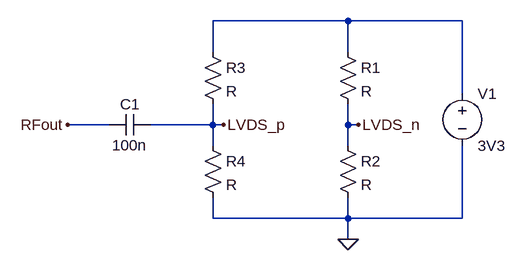
[diagram p0: schematic LVDS bias.asc]
LVDS bias.asc, the LTspice schematic file:
Version 4
SHEET 1 880 680
WIRE 192 32 -16 32
WIRE 368 32 192 32
WIRE -16 80 -16 32
WIRE 192 80 192 32
WIRE 368 144 368 32
WIRE -176 192 -240 192
WIRE -16 192 -16 160
WIRE -16 192 -112 192
WIRE 0 192 -16 192
WIRE 192 192 192 160
WIRE 208 192 192 192
WIRE -16 224 -16 192
WIRE 192 224 192 192
WIRE -16 336 -16 304
WIRE 192 336 192 304
WIRE 192 336 -16 336
WIRE 368 336 368 224
WIRE 368 336 192 336
WIRE 192 368 192 336
FLAG 192 368 0
FLAG -240 192 RFout
FLAG 0 192 LVDS_p
FLAG 208 192 LVDS_n
SYMBOL voltage 368 128 R0
WINDOW 123 0 0 Left 0
WINDOW 39 0 0 Left 0
SYMATTR InstName V1
SYMATTR Value 3V3
SYMBOL res 176 64 R0
SYMATTR InstName R1
SYMBOL res 176 208 R0
SYMATTR InstName R2
SYMBOL res -32 64 R0
SYMATTR InstName R3
SYMBOL res -32 208 R0
SYMATTR InstName R4
SYMBOL cap -112 176 R90
WINDOW 0 0 32 VBottom 2
WINDOW 3 32 32 VTop 2
SYMATTR InstName C1
SYMATTR Value 100n

The netlist it stands for:
* LVDS bias.asc
V1 N001 0 3V3
R1 N001 LVDS_n R
R2 LVDS_n 0 R
R3 N001 LVDS_p R
R4 LVDS_p 0 R
C1 LVDS_p RFout 100n
.backanno
.end